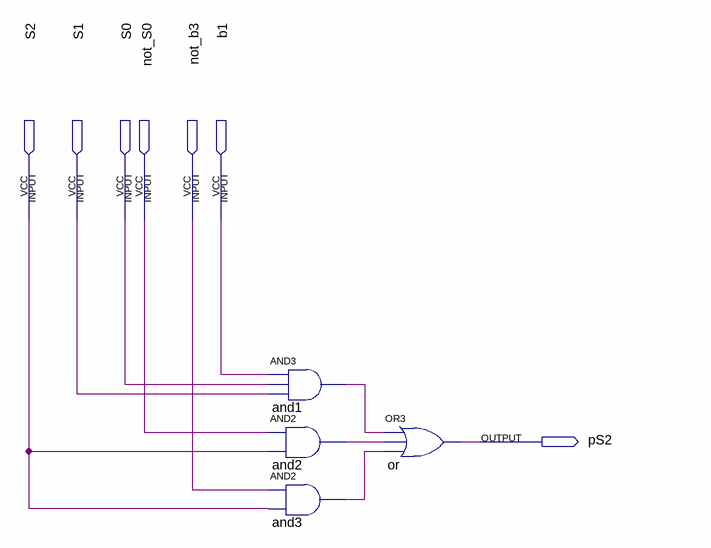
[diagram p0: schematic sheet]
// Quartus schematic prox_s2.bdf as structural Verilog: 4 symbols, 7 pins
module prox_s2 (
  input  S2,
  input  S1,
  input  S0,
  input  not_S0,
  input  not_b3,
  input  b1,
  output pS2
);

  wire and1_out, and2_out, and3_out;

  and and1 (and1_out, b1, S0, S1);
  and and2 (and2_out, not_S0, S2);
  and and3 (and3_out, not_b3, S2);
  or \or  (pS2, and1_out, and2_out, and3_out);
endmodule
